# Altium project armBoardProto.PrjPCB
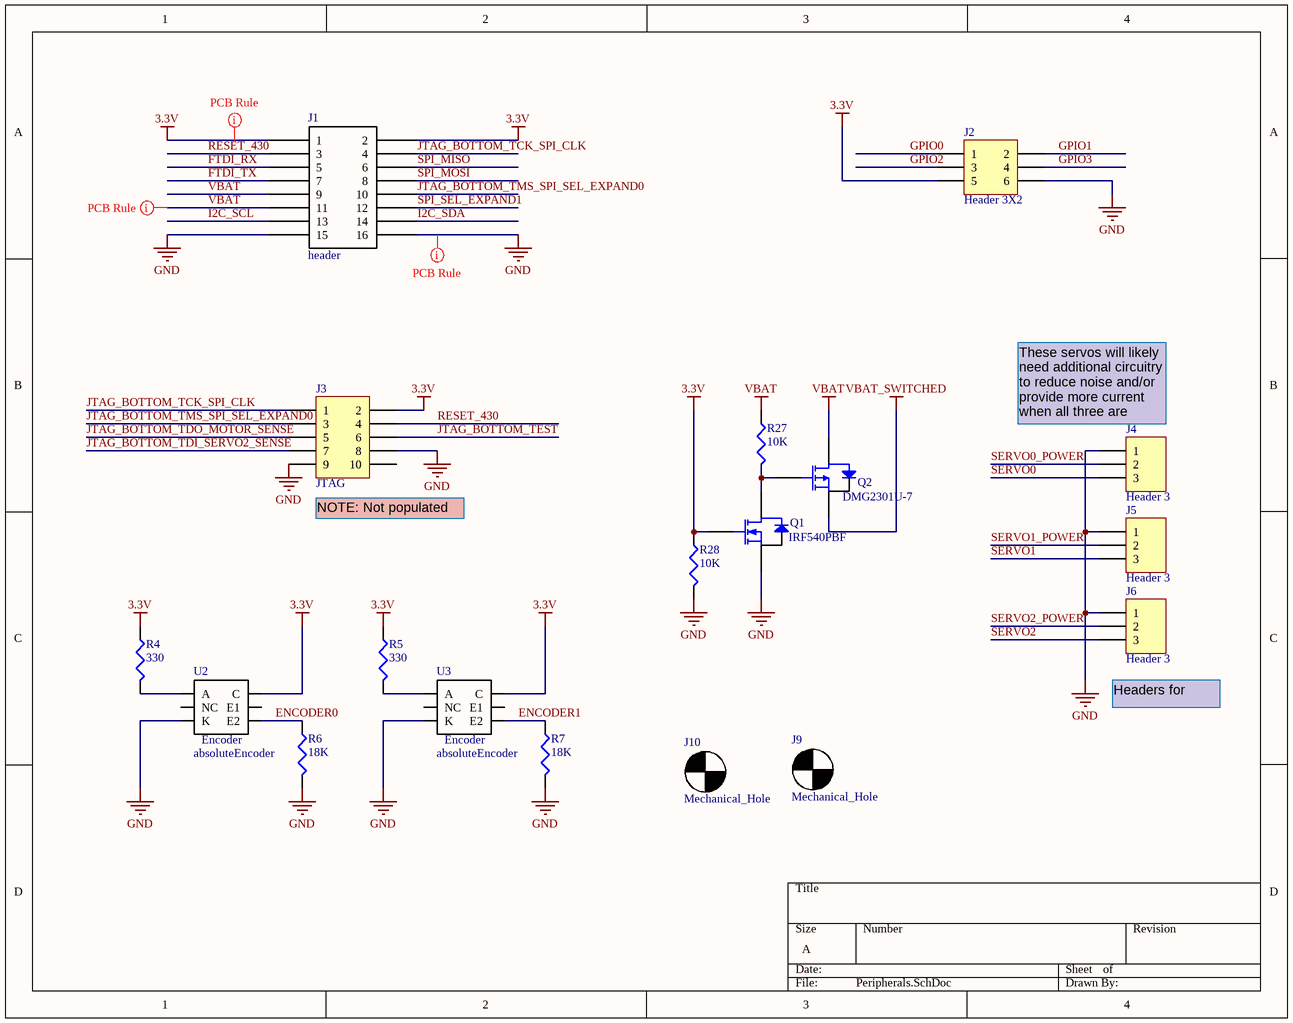
[diagram p0: Peripherals.SchDoc]
1 sheet, 18 parts. Net scope: global (net labels, ports and power ports of the same name join across sheets).
Board files: armBoardProto.PcbDoc, armBoardAlpha.PcbDoc, armBoardBeta.PcbDoc

## Sheet Peripherals.SchDoc
size A

### Parts
J1  header  [HEADERSM 8X2]
J2  Header 3X2  [HDR2X3]
J3  JTAG  [HDR2X5]
J4  Header 3  [HDR1X3]
J5  Header 3  [HDR1X3]
J6  Header 3  [HDR1X3]
J9  Mechanical_Hole  [#4_Screw_Hole]
J10  Mechanical_Hole  [#4_Screw_Hole]
Q1  IRF540PBF  [SOT-23]
Q2  DMG2301U-7  [SOT-23]
R4  value 330  [J1-0603]  (hidden comment: A)
R5  value 330  [J1-0603]  (hidden comment: A)
R6  value 18K  [J1-0603]  (hidden comment: E2)
R7  value 18K  [J1-0603]  (hidden comment: E2)
R27  value 10K  [J1-0603]
R28  value 10K  [J1-0603]
U2  absoluteEncoder  [absoluteEncoder]
U3  absoluteEncoder  [absoluteEncoder]

### Nets
3.3V: J1.1 J1.2 J2.5 J3.2 Q1.1(G) R4.1 R5.1 R28.1 U2.C U3.C
GND: J1.15 J1.16 J2.6 J3.8 J3.9 J4.1 J5.1 J6.1 Q1.2(S) R6.2 R7.2 R28.2 U2.K U3.K
VBAT: J1.9 J1.11 Q2.3(D) R27.1
VBAT_SWITCHED: Q2.2(S)
ENCODER0: R6.1 U2.E2
ENCODER1: R7.1 U3.E2
FTDI_RX: J1.5
FTDI_TX: J1.7
GPIO0: J2.1
GPIO1: J2.2
GPIO2: J2.3
GPIO3: J2.4
I2C_SCL: J1.13
I2C_SDA: J1.14
JTAG_BOTTOM_TCK_SPI_CLK: J1.4 J3.1
JTAG_BOTTOM_TDI_SERVO2_SENSE: J3.7
JTAG_BOTTOM_TDO_MOTOR_SENSE: J3.5
JTAG_BOTTOM_TEST: J3.6
JTAG_BOTTOM_TMS_SPI_SEL_EXPAND0: J1.10 J3.3
RESET_430: J1.3 J3.4
SERVO0: J4.3
SERVO0_POWER: J4.2
SERVO1: J5.3
SERVO1_POWER: J5.2
SERVO2: J6.3
SERVO2_POWER: J6.2
SPI_MISO: J1.6
SPI_MOSI: J1.8
SPI_SEL_EXPAND1: J1.12
NetQ1_3: Q1.3(D) Q2.1(G) R27.2
NetR4_2: R4.2 U2.A
NetR5_2: R5.2 U3.A

Not connected (* = marked no-connect by the designer): J3 10; U2 E1 NC; U3 E1 NC

### Layout directives
rule Width Constraint [Pref Width = 20mil    Min Width = 10mil    Max Width = 25mil]: 3.3V, GND, VBAT

### Notes on the sheet
- (near J4) These servos will likely need additional circuitry to reduce noise and/or provide more current when all three are going.
- (near J3) NOTE: Not populated
- (near J6) Headers for servos
- (in symbol absoluteEncoder) Encoder

### Library data of the parts
J1 = HEADER 8X2
J2 = Header 3X2: Header, 3-Pin, Dual row; LatestRevisionDate: 17-Jul-2002; LatestRevisionNote: Re-released for DXP Platform.; Publisher: Altium Limited
J3 = Header 5X2: Header, 5-Pin, Dual row; LatestRevisionDate: 17-Jul-2002; LatestRevisionNote: Re-released for DXP Platform.; Publisher: Altium Limited
J4-J6 = Header 3: Header, 3-Pin; LatestRevisionDate: 17-Jul-2002; LatestRevisionNote: Re-released for DXP Platform.; Publisher: Altium Limited
J9 J10 = Mechanical_Hole: A mechanical hole for mounting the board
Q1 = N-Mosfet
Q2 = P-Mosfet
R4-R7 R27 R28 = Res3: Resistor; Published: 8-Jun-2000; LatestRevisionDate: 29-May-2009; LatestRevisionNote: IPC-7351 Footprint Added.; PackageReference: J1-0603; Publisher: Altium Limited; PackageDescription: Chip Resistor